# Altium schematic sheet 01-Title_Page.SchDoc: Revision History and Contents
size A; Date: 4/25/2017; ApprovedBy: JSK; CheckedBy: JSK; Author: JSK; CompanyName: University of Wisconsin; DrawnBy: JSK; Engineer: JSK; Organization: ECE 315; Address1: College of Engineering; Address2: 1415 Engineering Drive; Address3: Madison, WI 53706; Address4: ECE 453 Spring 2017; Revision: A; SheetNumber: 1; SheetTotal: 2
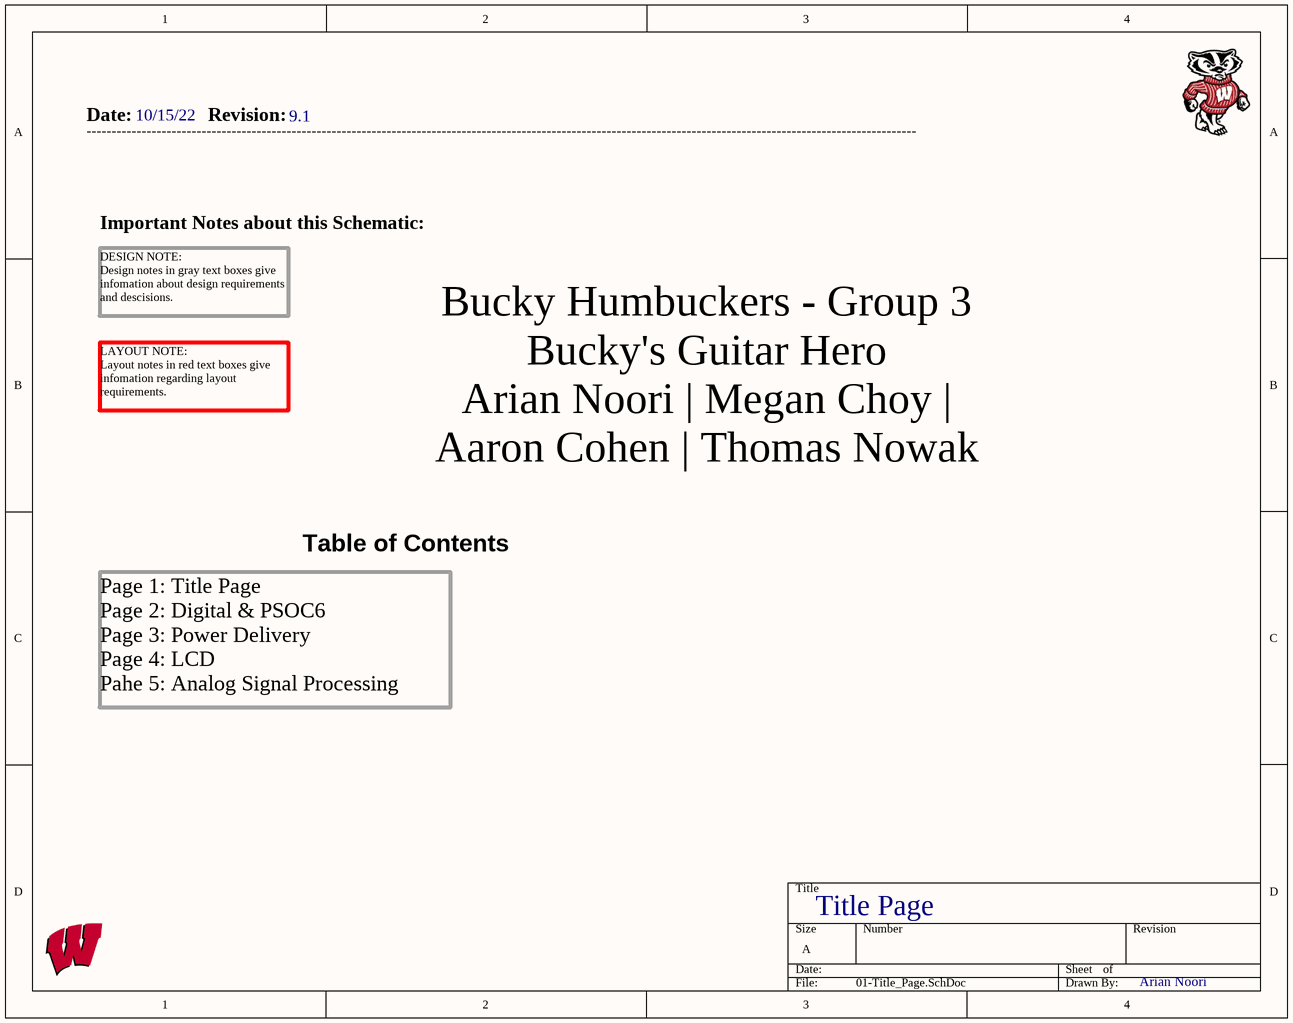
[diagram p0: 01-Title_Page.SchDoc]

## Notes on the sheet
- Date:
- ----------------------------------------------------------------------------------------------------------------------------------------------------------------------
- 10/15/22
- Revision:
- 9.1
- Important Notes about this Schematic:
- DESIGN NOTE:
  Design notes in gray text boxes give infomation about design requirements and descisions.
- LAYOUT NOTE:
  Layout notes in red text boxes give infomation regarding layout requirements.
- Bucky Humbuckers - Group 3
  Bucky's Guitar Hero
  Arian Noori | Megan Choy | Aaron Cohen | Thomas Nowak
- Table of Contents
- Page 1: Title Page
  Page 2: Digital & PSOC6
  Page 3: Power Delivery
  Page 4: LCD
  Pahe 5: Analog Signal Processing
- Title Page
- Arian Noori